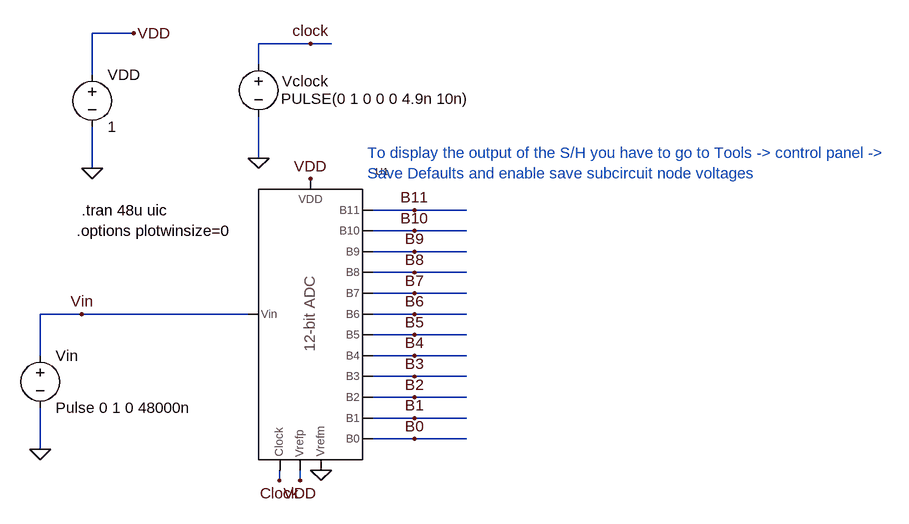
[diagram p0: schematic _Fig4_3_ideal_ADC.asc]
_Fig4_3_ideal_ADC.asc, the LTspice schematic file:
Version 4
SHEET 1 2740 696
WIRE 592 -816 528 -816
WIRE 864 -800 784 -800
WIRE 896 -800 864 -800
WIRE 784 -768 784 -800
WIRE 528 -752 528 -816
WIRE 784 -624 784 -688
WIRE 528 -608 528 -672
WIRE 1024 -544 960 -544
WIRE 1104 -544 1024 -544
WIRE 1024 -512 960 -512
WIRE 1104 -512 1024 -512
WIRE 1024 -480 960 -480
WIRE 1104 -480 1024 -480
WIRE 1024 -448 960 -448
WIRE 1104 -448 1024 -448
WIRE 1024 -416 960 -416
WIRE 1104 -416 1024 -416
WIRE 512 -384 448 -384
WIRE 768 -384 512 -384
WIRE 1024 -384 960 -384
WIRE 1104 -384 1024 -384
WIRE 1024 -352 960 -352
WIRE 1104 -352 1024 -352
WIRE 448 -320 448 -384
WIRE 1024 -320 960 -320
WIRE 1104 -320 1024 -320
WIRE 1024 -288 960 -288
WIRE 1104 -288 1024 -288
WIRE 1024 -256 960 -256
WIRE 1104 -256 1024 -256
WIRE 1024 -224 960 -224
WIRE 1104 -224 1024 -224
WIRE 1024 -192 960 -192
WIRE 1104 -192 1024 -192
WIRE 448 -176 448 -240
WIRE 816 -128 816 -144
WIRE 848 -128 848 -144
FLAG 448 -176 0
FLAG 512 -384 Vin
FLAG 784 -624 0
FLAG 864 -800 clock
FLAG 528 -608 0
FLAG 592 -816 VDD
FLAG 1024 -416 B7
FLAG 1024 -384 B6
FLAG 1024 -352 B5
FLAG 1024 -320 B4
FLAG 1024 -288 B3
FLAG 1024 -256 B2
FLAG 1024 -224 B1
FLAG 1024 -192 B0
FLAG 864 -592 VDD
FLAG 880 -144 0
FLAG 816 -128 Clock
FLAG 848 -128 VDD
FLAG 1024 -544 B11
FLAG 1024 -512 B10
FLAG 1024 -480 B9
FLAG 1024 -448 B8
SYMBOL voltage 448 -336 R0
WINDOW 123 0 0 Left 0
WINDOW 39 0 0 Left 0
SYMATTR InstName Vin
SYMATTR Value Pulse 0 1 0 48000n
SYMBOL voltage 784 -784 R0
WINDOW 0 36 42 Left 0
WINDOW 3 35 69 Left 0
WINDOW 123 0 0 Left 0
WINDOW 39 0 0 Left 0
SYMATTR InstName Vclock
SYMATTR Value PULSE(0 1 0 0 0 4.9n 10n)
SYMBOL voltage 528 -768 R0
WINDOW 123 0 0 Left 0
WINDOW 39 0 0 Left 0
SYMATTR InstName VDD
SYMATTR Value 1
SYMBOL Ideal_12_bit_ADC 784 -160 R0
SYMATTR InstName U1
TEXT 512 -544 Left 0 !.tran 48u uic
TEXT 952 -632 Left 0 ;To display the output of the S/H you have to go to Tools -> control panel ->\nSave Defaults and enable save subcircuit node voltages
TEXT 504 -512 Left 0 !.options plotwinsize=0

The netlist it stands for:
* _Fig4_3_ideal_ADC.asc
Vin Vin 0 Pulse 0 1 0 48000n
Vclock clock 0 PULSE(0 1 0 0 0 4.9n 10n)
VDD VDD 0 1
XU1 B11 B10 B9 B8 B7 B6 B5 B4 B3 B2 B1 B0 Vin VDD 0 clock VDD Ideal_12_bit_ADC  ; pins B11 B10 B9 B8 B7 B6 B5 B4 B3 B2 B1 B0 Vin Vrefp Vrefm Clock VDD
.tran 48u uic
* To display the output of the S/H you have to go to Tools -> control panel ->
* Save Defaults and enable save subcircuit node voltages
.options plotwinsize=0
.backanno
.end